# Altium project Universal driver v2.PrjPcb
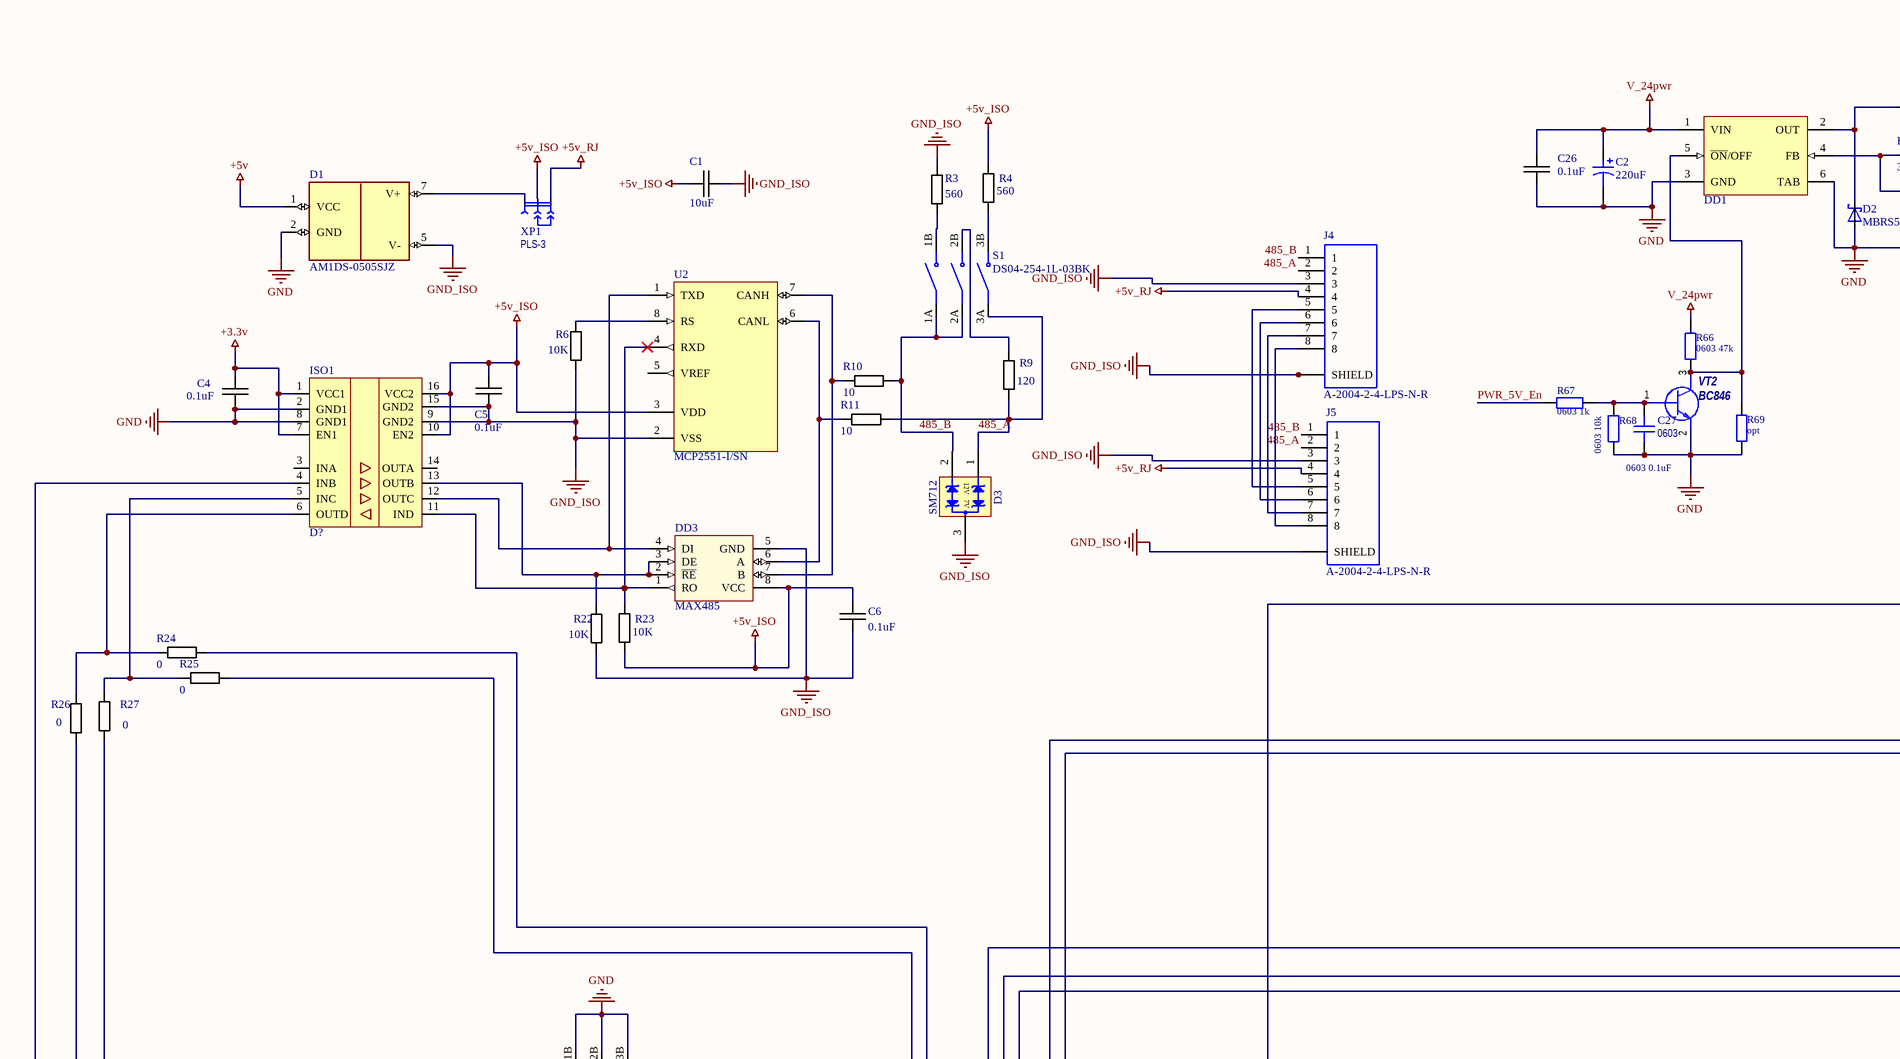
[diagram p0: universal driver v2.SchDoc, top left]
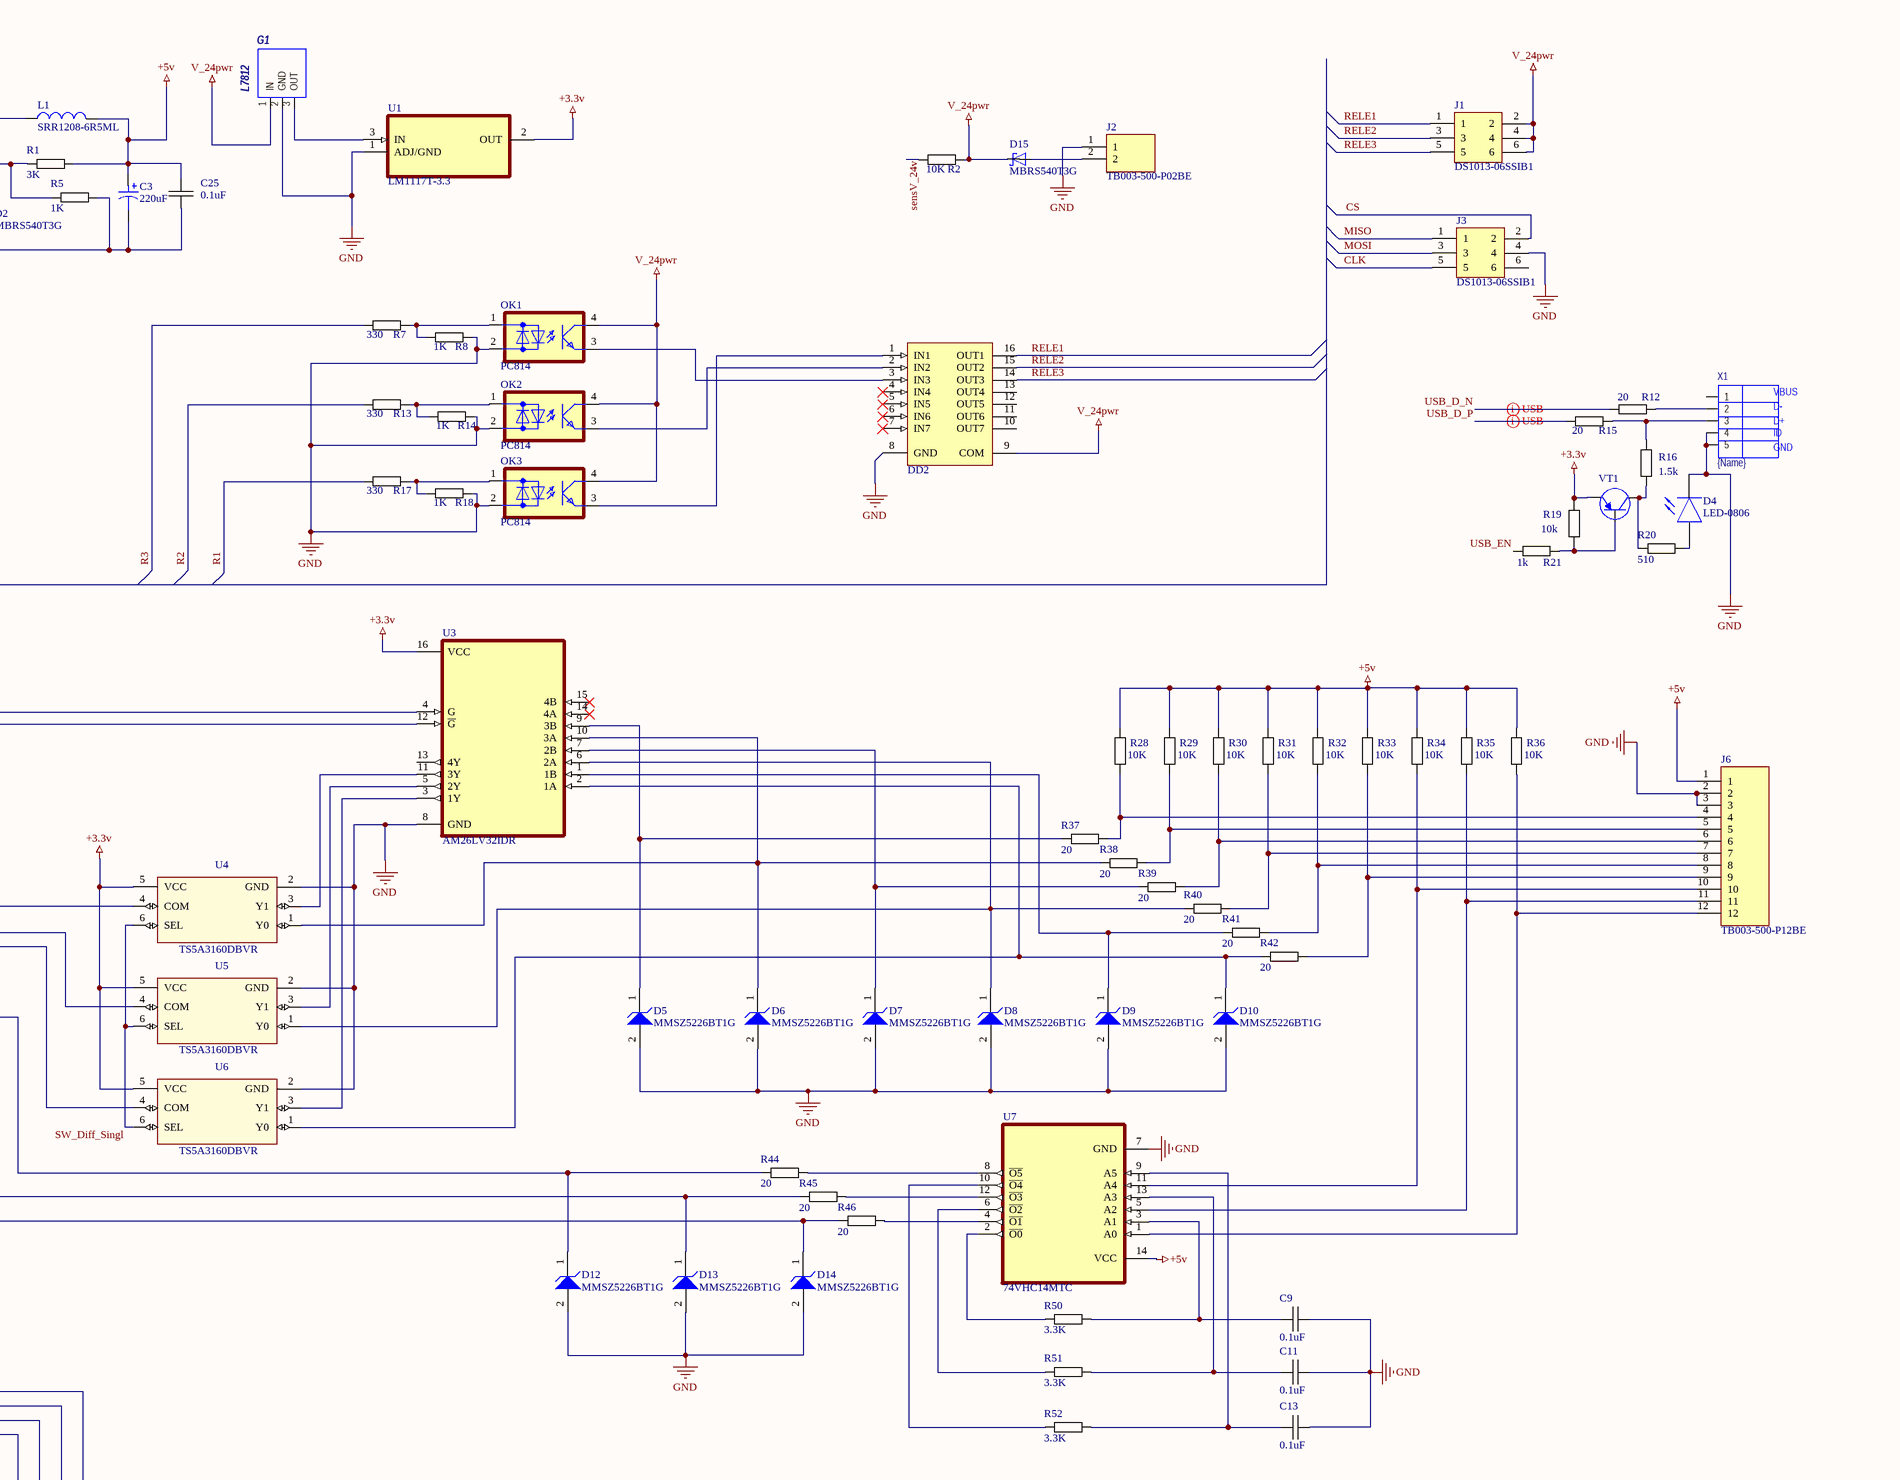
[diagram p1: universal driver v2.SchDoc, top right]
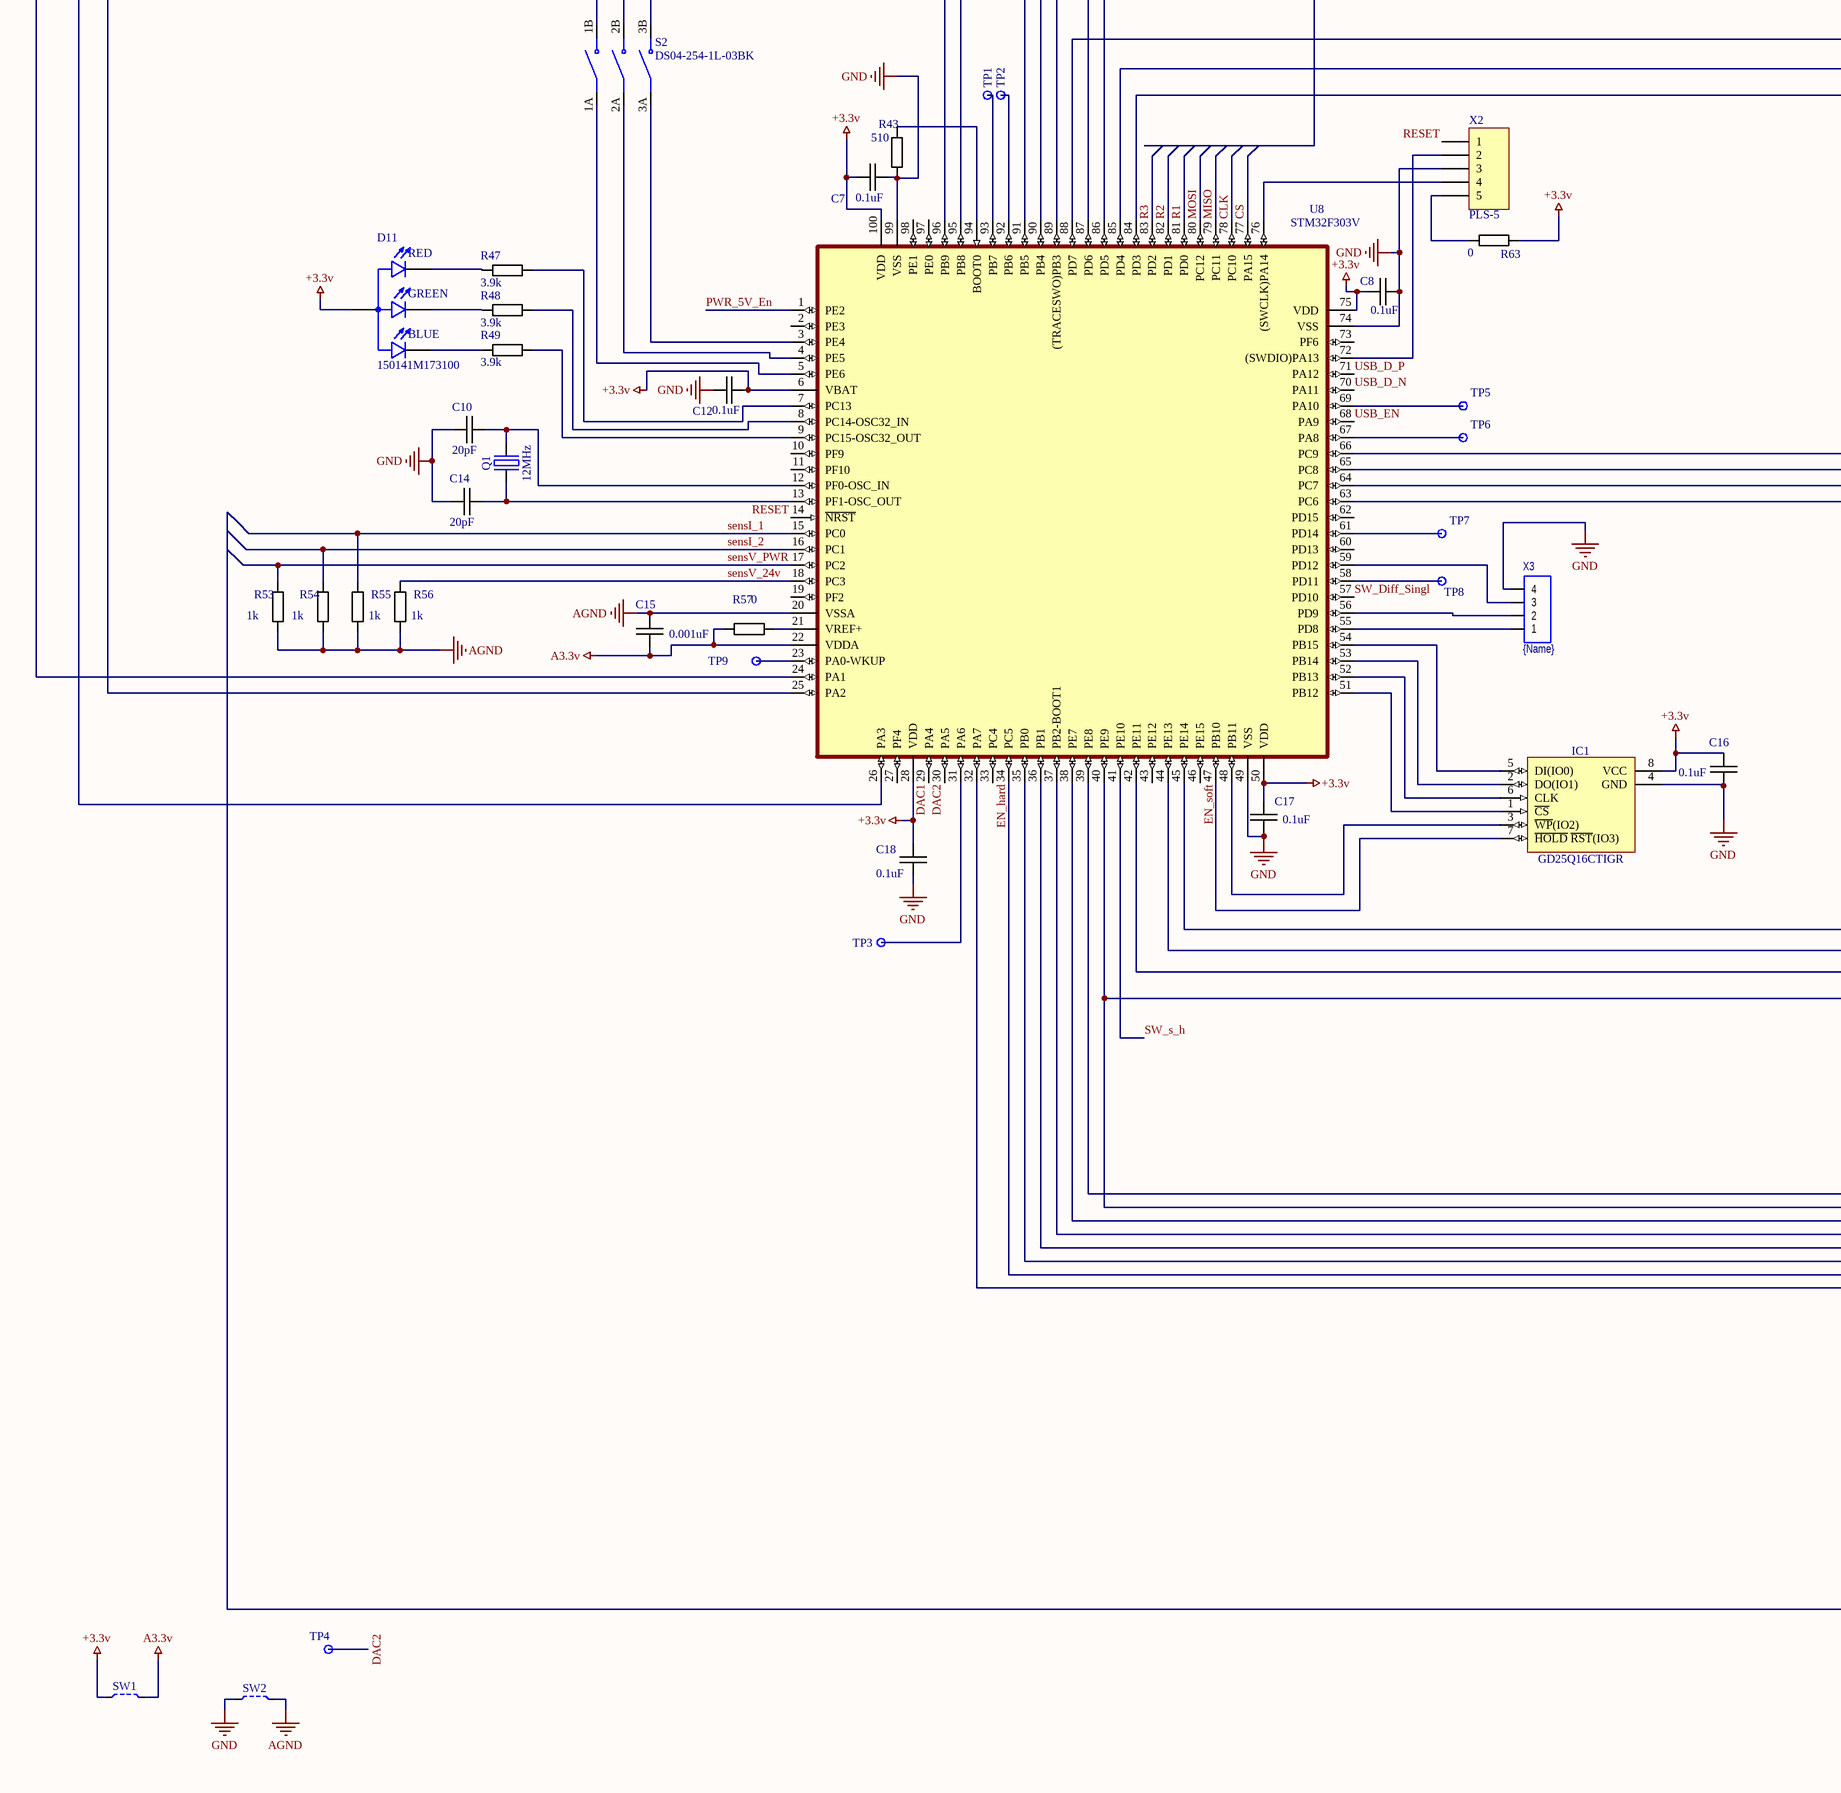
[diagram p2: universal driver v2.SchDoc, bottom left]
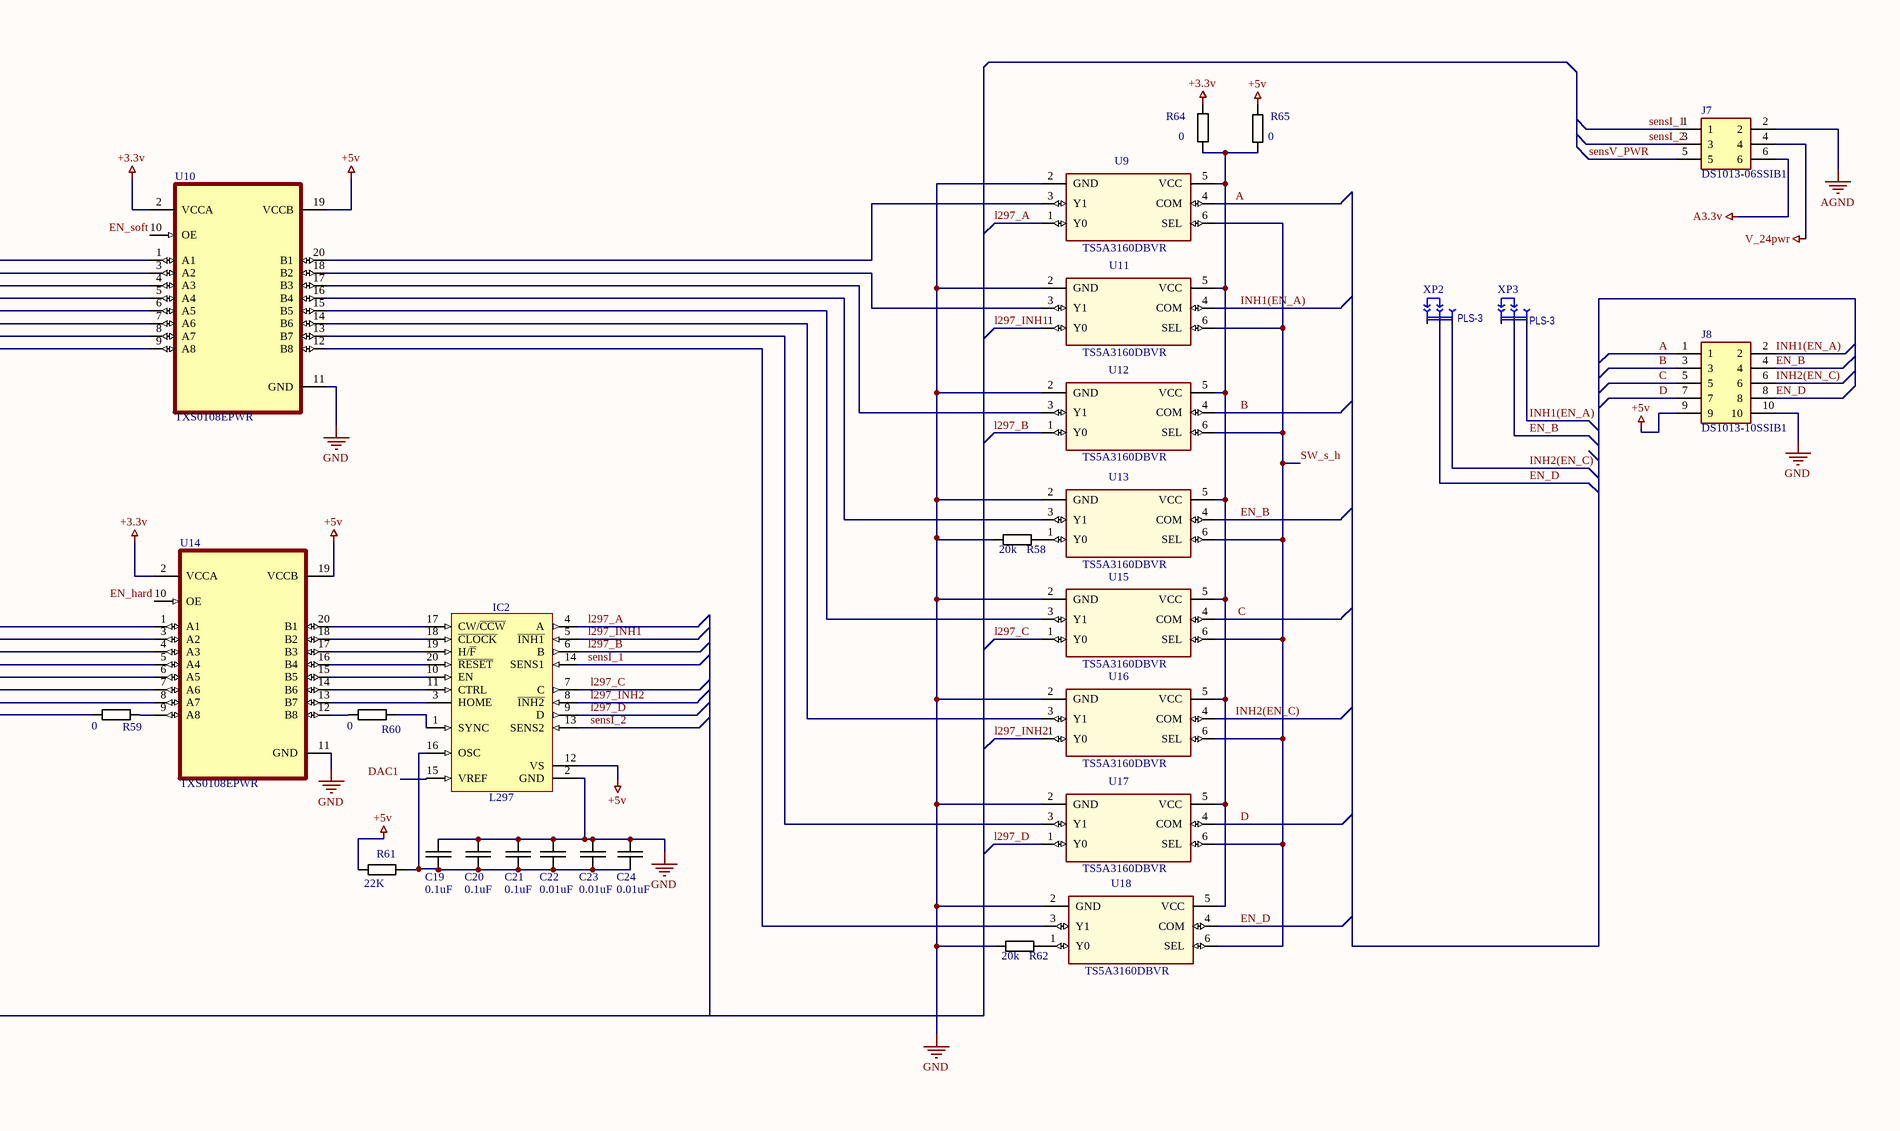
[diagram p3: universal driver v2.SchDoc, bottom right]
1 sheet, 170 parts. Net scope: global (net labels, ports and power ports of the same name join across sheets).
Board file: Universal_Driver v2.PcbDoc

## Sheet universal driver v2.SchDoc
size A1

### Parts
C1  10uF  [CAPC3225X270N]
C2  value 220uF  [ECR 10x13mm]  (hidden comment: 220uF 50v)
C3  value 220uF  [ECR 10x13mm]  (hidden comment: 220uF 50v)
C4  0.1uF  [CAPACITOR 0603]
C5  0.1uF  [CAPACITOR 0603]
C6  0.1uF  [CAPACITOR 0603]
C7  0.1uF  [CAPACITOR 0603]
C8  0.1uF  [CAPACITOR 0603]
C9  0.1uF  [CAPACITOR 0603]
C10  20pF  [CAPACITOR 0603]
C11  0.1uF  [CAPACITOR 0603]
C12  0.1uF  [CAPACITOR 0603]
C13  0.1uF  [CAPACITOR 0603]
C14  20pF  [CAPACITOR 0603]
C15  0.001uF  [CAPACITOR 0603]
C16  0.1uF  [CAPACITOR 0603]
C17  0.1uF  [CAPACITOR 0603]
C18  0.1uF  [CAPACITOR 0603]
C19  0.1uF  [CAPACITOR 0603]
C20  0.1uF  [CAPACITOR 0603]
C21  0.1uF  [CAPACITOR 0603]
C22  0.01uF  [CAPACITOR 0603]
C23  0.01uF  [CAPACITOR 0603]
C24  0.01uF  [CAPACITOR 0603]
C25  0.1uF  [CAPACITOR 0603]
C26  0.1uF  [CAPACITOR 0603]
C27  Body: 0603  [CAPCHIP0603]  (hidden comment: 0603 0.1uF)
D1  AM1DS-0505SJZ  [AM2D-NZ]
D2  MBRS540T3G  [DIOM7958X213N]
D3  SM712  [SOT23]
D4  LED-0806  [RESC0805X60N]
D5  MMSZ5226BT1G  [ONSC-SOD-123-2-425-04_V]
D6  MMSZ5226BT1G  [ONSC-SOD-123-2-425-04_V]
D7  MMSZ5226BT1G  [ONSC-SOD-123-2-425-04_V]
D8  MMSZ5226BT1G  [ONSC-SOD-123-2-425-04_V]
D9  MMSZ5226BT1G  [ONSC-SOD-123-2-425-04_V]
D10  MMSZ5226BT1G  [ONSC-SOD-123-2-425-04_V]
D11  150141M173100  [LED_150141M173100]
D12  MMSZ5226BT1G  [ONSC-SOD-123-2-425-04_V]
D13  MMSZ5226BT1G  [ONSC-SOD-123-2-425-04_V]
D14  MMSZ5226BT1G  [ONSC-SOD-123-2-425-04_V]
D15  MBRS540T3G  [DIOM7958X213N]
DD1  LM2596S-ADJ  [TO-263]  (value not drawn)
DD2  ULN2003  [NSO16]  (value not drawn)
DD3  MAX485  [NSO8]
G1  Name: L7812  [D2PAK_M]  (hidden comment: L7812C - V)
IC1  GD25Q16CTIGR  [NSO8]
IC2  L297  [DIP850W45P254L2540H393Q20]
ISO1  D?  [*SOIC127P1030X265-16N]
J1  DS1013-06SSIB1  [CONNFLY_DS1013-06SSIB1]
J2  TB003-500-P02BE  [CUI_TB003-500-P02BE]
J3  DS1013-06SSIB1  [CONNFLY_DS1013-06SSIB1]
J4  A-2004-2-4-LPS-N-R  [ASSMANN_A-2004-2-4-LPS-N-R]
J5  A-2004-2-4-LPS-N-R  [ASSMANN_A-2004-2-4-LPS-N-R]
J6  TB003-500-P12BE  [CUI_TB003-500-P12BE]
J7  DS1013-06SSIB1  [CONNFLY_DS1013-06SSIB1]
J8  DS1013-10SSIB1  [CONNFLY_DS1013-10SSIB1]
L1  SRR1208-6R5ML  [SRR1208]
OK1  PC814  [DIL04]
OK2  PC814  [DIL04]
OK3  PC814  [DIL04]
Q1  12MHz  [HC49SM]
R1  3K  [Resistor 0805]
R2  10K  [Resistor 0805]
R3  560  [Resistor 0805]
R4  560  [Resistor 0805]
R5  1K  [Resistor 0805]
R6  10K  [Resistor 0805]
R7  330  [Resistor 0805]
R8  1K  [Resistor 0805]
R9  120  [Resistor 0805]
R10  10  [Resistor 0805]
R11  10  [Resistor 0805]
R12  20  [Resistor 0805]
R13  330  [Resistor 0805]
R14  1K  [Resistor 0805]
R15  20  [Resistor 0805]
R16  1.5k  [Resistor 0805]
R17  330  [Resistor 0805]
R18  1K  [Resistor 0805]
R19  10k  [Resistor 0805]
R20  510  [Resistor 0805]
R21  1k  [Resistor 0805]
R22  10K  [Resistor 0805]
R23  10K  [Resistor 0805]
R24  0  [Resistor 0805]
R25  0  [Resistor 0805]
R26  0  [Resistor 0805]
R27  0  [Resistor 0805]
R28  10K  [Resistor 0805]
R29  10K  [Resistor 0805]
R30  10K  [Resistor 0805]
R31  10K  [Resistor 0805]
R32  10K  [Resistor 0805]
R33  10K  [Resistor 0805]
R34  10K  [Resistor 0805]
R35  10K  [Resistor 0805]
R36  10K  [Resistor 0805]
R37  20  [Resistor 0805]
R38  20  [Resistor 0805]
R39  20  [Resistor 0805]
R40  20  [Resistor 0805]
R41  20  [Resistor 0805]
R42  20  [Resistor 0805]
R43  510  [Resistor 0805]
R44  20  [Resistor 0805]
R45  20  [Resistor 0805]
R46  20  [Resistor 0805]
R47  3.9k  [Resistor 0805]
R48  3.9k  [Resistor 0805]
R49  3.9k  [Resistor 0805]
R50  3.3K  [Resistor 0805]
R51  3.3K  [Resistor 0805]
R52  3.3K  [Resistor 0805]
R53  1k  [Resistor 0805]
R54  1k  [Resistor 0805]
R55  1k  [Resistor 0805]
R56  1k  [Resistor 0805]
R57  0  [Resistor 0805]
R58  20k  [Resistor 0805]
R59  0  [Resistor 0805]
R60  0  [Resistor 0805]
R61  22K  [Resistor 0805]
R62  20k  [Resistor 0805]
R63  0  [Resistor 0805]
R64  0  [Resistor 0805]
R65  0  [Resistor 0805]
R66  0603 47k  [RESCHIP0603]
R67  0603 1k  [RESCHIP0603]
R68  0603 10k  [RESCHIP0603]
R69  opt  [RESCHIP0603]
S1  DS04-254-1L-03BK  [SW_DS04-254-1L-03BK]
S2  DS04-254-1L-03BK  [SW_DS04-254-1L-03BK]
SW1  (no value)  [R - 1206]
SW2  (no value)  [R - 1206]
TP1  (no value)  [PIN1]
TP2  (no value)  [PIN1]
TP3  (no value)  [PIN1]
TP4  (no value)  [PIN1]
TP5  (no value)  [PIN1]
TP6  (no value)  [PIN1]
TP7  (no value)  [PIN1]
TP8  (no value)  [PIN1]
TP9  (no value)  [PIN1]
U1  LM1117T-3.3  [TO254P470X1016X2222-3P]
U2  MCP2551-I/SN  [SOIC-SN8_L]
U3  AM26LV32IDR  [SOIC127P600X175-16N]
U4  TS5A3160DBVR  [*SOT95P280X145-6N]
U5  TS5A3160DBVR  [*SOT95P280X145-6N]
U6  TS5A3160DBVR  [*SOT95P280X145-6N]
U7  74VHC14MTC  [SOP65P640X120-14N]
U8  STM32F303V  [QFP50P1600X1600X160-100N]
U9  TS5A3160DBVR  [*SOT95P280X145-6N]
U10  TXS0108EPWR  [SOP65P640X120-20N]
U11  TS5A3160DBVR  [*SOT95P280X145-6N]
U12  TS5A3160DBVR  [*SOT95P280X145-6N]
U13  TS5A3160DBVR  [*SOT95P280X145-6N]
U14  TXS0108EPWR  [SOP65P640X120-20N]
U15  TS5A3160DBVR  [*SOT95P280X145-6N]
U16  TS5A3160DBVR  [*SOT95P280X145-6N]
U17  TS5A3160DBVR  [*SOT95P280X145-6N]
U18  TS5A3160DBVR  [*SOT95P280X145-6N]
VT1  PNP BEC  [SOT23]  (value not drawn)
VT2  BC846  [SOT23]
X1  Name: {Name}  [X - Micro USB B (Bottom mount ass'y)]  (hidden comment: 47346-0001(molex))
X2  PLS-5  [PLS-5-3D]
X3  Name: {Name}  [X - PLS - 4]  (hidden comment: PLS-4)
XP1  PLS-3  [ZL201-3]
XP2  PLS-3  [ZL201-3]
XP3  PLS-3  [ZL201-3]

### Nets
+3.3v: C4.1 C7.1 C8.1 C12.2 C16.1 C17.1 C18.1 D11.1(A) IC1.8(VCC) ISO1.1(VCC1) ISO1.7(EN1) R19.2 R63.1 R64.1 SW1.1 U1.2(OUT) U3.16(VCC) U4.5(VCC) U5.5(VCC) U6.5(VCC) U8.6(VBAT) U8.28(VDD) U8.50(VDD) U8.75(VDD) U8.100(VDD) U10.2(VCCA) U14.2(VCCA) VT1.2(E)
+5v: C3.1 C25.2 D1.1(VCC) IC2.12(VS) J6.1 J8.9 L1.P$2 R1.2 R28.2 R29.2 R30.2 R31.2 R32.2 R33.2 R34.2 R35.2 R36.2 R61.2 R65.1 U7.14(VCC) U10.19(VCCB) U14.19(VCCB)
+5v_ISO: C1.2 C5.2 C6.2 DD3.8(VCC) ISO1.10(EN2) ISO1.16(VCC2) R4.2 R23.1 U2.3(VDD) XP1.2
+5v_RJ: J4.4 J5.4 XP1.1
A3.3v: C15.2 J7.6 R57.2 SW1.2 U8.22(VDDA)
AGND: C15.1 J7.2 R53.2 R54.2 R55.2 R56.2 SW2.2 U8.20(VSSA)
GND: C2.2 C3.2 C4.2 C7.2 C8.2 C9.2 C10.1 C11.2 C12.1 C13.2 C14.1 C16.2 C17.2 C18.2 C19.2 C20.2 C21.2 C22.2 C23.2 C24.2 C25.1 C26.1 C27.1 D1.2(GND) D2.A D4.1(C) D5.2(A) D6.2(A) D7.2(A) D8.2(A) D9.2(A) D10.2(A) D12.2(A) D13.2(A) D14.2(A) DD1.3(GND) DD1.6(TAB) DD2.8(GND) G1.2(GND) IC1.4(GND) IC2.2(GND) ISO1.2(GND1) ISO1.8(GND1) J2.1 J3.4 J6.2 J6.3 J8.10 OK1.2(AC2) OK2.2(AC2) OK3.2(AC2) R5.2 R8.2 R14.2 R18.2 R43.2 R58.1 R62.1 R68.2 R69.2 S2.1B(NO1) S2.2B(NO2) S2.3B(NO3) SW2.1 U1.1(ADJ/GND) U3.8(GND) U4.2(GND) U5.2(GND) U6.2(GND) U7.7(GND) U8.49(VSS) U8.74(VSS) U8.99(VSS) U9.2(GND) U10.11(GND) U11.2(GND) U12.2(GND) U13.2(GND) U14.11(GND) U15.2(GND) U16.2(GND) U17.2(GND) U18.2(GND) VT2.2(E) X1.4 X1.5 X2.3 X3.4
GND_ISO: C1.1 C5.1 C6.1 D1.5(V-) D3.3(GND) DD3.5(GND) ISO1.9(GND2) ISO1.15(GND2) J4.3 J4.S1(SHIELD) J4.S2(SHIELD) J5.3 J5.S1(SHIELD) J5.S2(SHIELD) R3.2 R6.1 R22.2 U2.2(VSS)
V_24pwr: C2.1 C26.2 D15.C DD1.1(VIN) DD2.9(COM) G1.1(IN) J1.2 J1.4 J1.6 J7.4 OK1.4(C) OK2.4(C) OK3.4(C) R2.2 R66.2
485_A: D3.1(I/O1) J4.2 J5.2 R9.2 R11.1 S1.3A(COM3)
485_B: D3.2(I/O2) J4.1 J5.1 R10.1 S1.1A(COM1) S1.2A(COM2)
A: J8.1 U9.4(COM)
B: J8.3 U12.4(COM)
C: J8.5 U15.4(COM)
CLK: J3.5 U8.78(PC10)
CS: J3.2 U8.77(PA15)
D: J8.7 U17.4(COM)
DAC1: IC2.15(VREF) U8.29(PA4)
DAC2: TP4.1 U8.30(PA5)
EN_B: J8.4 U13.4(COM) XP3.2
EN_D: J8.8 U18.4(COM) XP2.2
EN_hard: U8.33(PC4) U14.10(OE)
EN_soft: U8.46(PE15) U10.10(OE)
INH1(EN_A): J8.2 U11.4(COM) XP3.3
INH2(EN_C): J8.6 U16.4(COM) XP2.3
l297_A: IC2.4(A) U9.1(Y0)
l297_B: IC2.6(B) U12.1(Y0)
l297_C: IC2.7(C) U15.1(Y0)
l297_D: IC2.9(D) U17.1(Y0)
l297_INH1: IC2.5(~{INH1}) U11.1(Y0)
l297_INH2: IC2.8(~{INH2}) U16.1(Y0)
MISO: J3.1 U8.79(PC11)
MOSI: J3.3 U8.80(PC12)
PWR_5V_En: R67.1 U8.1(PE2)
R1: R17.1 U8.81(PD0)
R2: R13.1 U8.82(PD1)
R3: R7.1 U8.83(PD2)
RELE1: DD2.16(OUT1) J1.1
RELE2: DD2.15(OUT2) J1.3
RELE3: DD2.14(OUT3) J1.5
RESET: U8.14(~{NRST}) X2.1
sensI_1: IC2.14(SENS1) J7.1 R55.1 U8.15(PC0)
sensI_2: IC2.13(SENS2) J7.3 R54.1 U8.16(PC1)
sensV_24v: R2.1 R56.1 U8.18(PC3)
sensV_PWR: J7.5 R53.1 U8.17(PC2)
SW_Diff_Singl: U4.6(SEL) U5.6(SEL) U6.6(SEL) U8.57(PD10)
SW_s_h: U8.41(PE10) U9.6(SEL) U11.6(SEL) U12.6(SEL) U13.6(SEL) U15.6(SEL) U16.6(SEL) U17.6(SEL) U18.6(SEL)
USB_D_N: R12.1 U8.70(PA11)
USB_D_P: R15.1 U8.71(PA12)
USB_EN: R21.1 U8.68(PA9)
NetC9_1: C9.1 R50.1 U7.3(A1)
NetC10_2: C10.2 Q1.2(OSC2) U8.12(PF0-OSC_IN)
NetC11_1: C11.1 R51.1 U7.13(A3)
NetC13_1: C13.1 R52.1 U7.9(A5)
NetC14_2: C14.2 Q1.1(OSC1) U8.13(PF1-OSC_OUT)
NetC19_1: C19.1 C20.1 C21.1 C22.1 C23.1 C24.1 IC2.16(OSC) R61.1
NetC27_2: C27.2 R67.2 R68.1 VT2.1(B)
NetD1_7: D1.7(V+) XP1.3
NetD2_C: D2.C DD1.2(OUT) L1.P$1
NetD4_2: D4.2(A) R20.1
NetD5_1: D5.1(K) R37.2 U3.9(3B)
NetD6_1: D6.1(K) R38.2 U3.10(3A) U4.1(Y0)
NetD7_1: D7.1(K) R39.2 U3.7(2B)
NetD8_1: D8.1(K) R40.2 U3.6(2A) U5.1(Y0)
NetD9_1: D9.1(K) R41.2 U3.1(1B)
NetD10_1: D10.1(K) R42.2 U3.2(1A) U6.1(Y0)
NetD11_2: D11.2(B_C) R49.2
NetD11_3: D11.3(R_C) R47.2
NetD11_4: D11.4(G_C) R48.2
NetD12_1: D12.1(K) R44.2 U8.88(PD7)
NetD13_1: D13.1(K) R45.2 U8.85(PD4)
NetD14_1: D14.1(K) R46.2 U8.84(PD3)
NetD15_A: D15.A J2.2
NetDD1_4: DD1.4(FB) R1.1 R5.1
NetDD1_5: DD1.5(~{ON}/OFF) R66.1 R69.1 VT2.3(C)
NetDD2_1: DD2.1(IN1) OK3.3(E)
NetDD2_2: DD2.2(IN2) OK2.3(E)
NetDD2_3: DD2.3(IN3) OK1.3(E)
NetDD3_1: DD3.1(RO) ISO1.11(IND) R23.2 U2.4(RXD)
NetDD3_2: DD3.2(~{RE}) DD3.3(DE) ISO1.13(OUTB) R22.1
NetDD3_4: DD3.4(DI) ISO1.12(OUTC) U2.1(TXD)
NetDD3_6: DD3.6(A) R11.2 U2.6(CANL)
NetDD3_7: DD3.7(B) R10.2 U2.7(CANH)
NetG1_3: G1.3(OUT) U1.3(IN)
NetIC1_1: IC1.1(~{CS}) U8.51(PB12)
NetIC1_2: IC1.2(DO(IO1)) U8.53(PB14)
NetIC1_3: IC1.3(~{WP}(IO2)) U8.48(PB11)
NetIC1_5: IC1.5(DI(IO0)) U8.54(PB15)
NetIC1_6: IC1.6(CLK) U8.52(PB13)
NetIC1_7: IC1.7(~{HOLD}_~{RST}(IO3)) U8.47(PB10)
NetIC2_1: IC2.1(SYNC) R60.1
NetIC2_3: IC2.3(HOME) U14.13(B7)
NetIC2_10: IC2.10(EN) U14.15(B5)
NetIC2_11: IC2.11(CTRL) U14.14(B6)
NetIC2_17: IC2.17(CW/~{CCW}) U14.20(B1)
NetIC2_18: IC2.18(~{CLOCK}) U14.18(B2)
NetIC2_19: IC2.19(H/~{F}) U14.17(B3)
NetIC2_20: IC2.20(~{RESET}) U14.16(B4)
NetISO1_4: ISO1.4(INB) U8.24(PA1)
NetISO1_5: ISO1.5(INC) R25.2 R27.2
NetISO1_6: ISO1.6(OUTD) R24.2 R26.1
NetJ4_5: J4.5 J5.5
NetJ4_6: J4.6 J5.6
NetJ4_7: J4.7 J5.7
NetJ4_8: J4.8 J5.8
NetJ6_4: J6.4 R28.1 R37.1
NetJ6_5: J6.5 R29.1 R38.1
NetJ6_6: J6.6 R30.1 R39.1
NetJ6_7: J6.7 R31.1 R40.1
NetJ6_8: J6.8 R32.1 R41.1
NetJ6_9: J6.9 R33.1 R42.1
NetJ6_10: J6.10 R34.1 U7.11(A4)
NetJ6_11: J6.11 R35.1 U7.5(A2)
NetJ6_12: J6.12 R36.1 U7.1(A0)
NetOK1_1: OK1.1(AC1) R7.2 R8.1
NetOK2_1: OK2.1(AC1) R13.2 R14.1
NetOK3_1: OK3.1(AC1) R17.2 R18.1
NetR3_1: R3.1 S1.1B(NO1)
NetR4_1: R4.1 S1.3B(NO3)
NetR6_2: R6.2 U2.8(RS)
NetR9_1: R9.1 S1.2B(NO2)
NetR12_2: R12.2 X1.2
NetR15_2: R15.2 R16.1 X1.3
NetR16_2: R16.2 R20.2 VT1.3(C)
NetR19_1: R19.1 R21.2 VT1.1(B)
NetR24_1: R24.1 U8.95(PB8)
NetR25_1: R25.1 U8.96(PB9)
NetR26_2: R26.2 U8.26(PA3)
NetR27_1: R27.1 U8.25(PA2)
NetR43_1: R43.1 U8.94(BOOT0)
NetR44_1: R44.1 U7.8(~{O5})
NetR45_1: R45.1 U7.12(~{O3})
NetR46_1: R46.1 U7.4(~{O1})
NetR47_1: R47.1 U8.7(PC13)
NetR48_1: R48.1 U8.8(PC14-OSC32_IN)
NetR49_1: R49.1 U8.9(PC15-OSC32_OUT)
NetR50_2: R50.2 U7.2(~{O0})
NetR51_2: R51.2 U7.6(~{O2})
NetR52_2: R52.2 U7.10(~{O4})
NetR57_1: R57.1 U8.21(VREF+)
NetR58_2: R58.2 U13.1(Y0)
NetR59_1: R59.1 U14.9(A8)
NetR59_2: R59.2 U8.32(PA7)
NetR60_2: R60.2 U14.12(B8)
NetR62_2: R62.2 U18.1(Y0)
NetR63_2: R63.2 X2.5
NetR64_2: R64.2 R65.2 U9.5(VCC) U11.5(VCC) U12.5(VCC) U13.5(VCC) U15.5(VCC) U16.5(VCC) U17.5(VCC) U18.5(VCC)
NetS2_1A: S2.1A(COM1) U8.5(PE6)
NetS2_2A: S2.2A(COM2) U8.4(PE5)
NetS2_3A: S2.3A(COM3) U8.3(PE4)
NetTP1_1: TP1.1 U8.93(PB7)
NetTP2_1: TP2.1 U8.92(PB6)
NetTP3_1: TP3.1 U8.31(PA6)
NetTP5_1: TP5.1 U8.69(PA10)
NetTP6_1: TP6.1 U8.67(PA8)
NetTP7_1: TP7.1 U8.61(PD14)
NetTP8_1: TP8.1 U8.58(PD11)
NetTP9_1: TP9.1 U8.23(PA0-WKUP)
NetU3_3: U3.3(1Y) U6.3(Y1)
NetU3_4: U3.4(G) U8.87(PD6)
NetU3_5: U3.5(2Y) U5.3(Y1)
NetU3_11: U3.11(3Y) U4.3(Y1)
NetU3_12: U3.12(~{G}) U8.86(PD5)
NetU4_4: U4.4(COM) U8.91(PB5)
NetU5_4: U5.4(COM) U8.90(PB4)
NetU6_4: U6.4(COM) U8.89((TRACESWO)PB3)
NetU8_34: U8.34(PC5) U14.8(A7)
NetU8_35: U8.35(PB0) U14.7(A6)
NetU8_36: U8.36(PB1) U14.6(A5)
NetU8_37: U8.37(PB2-BOOT1) U14.5(A4)
NetU8_38: U8.38(PE7) U14.4(A3)
NetU8_39: U8.39(PE8) U14.1(A1)
NetU8_40: U8.40(PE9) U10.9(A8) U14.3(A2)
NetU8_42: U8.42(PE11) U10.8(A7)
NetU8_44: U8.44(PE13) U10.7(A6)
NetU8_45: U8.45(PE14) U10.6(A5)
NetU8_55: U8.55(PD8) X3.1
NetU8_56: U8.56(PD9) X3.2
NetU8_59: U8.59(PD12) X3.3
NetU8_63: U8.63(PC6) U10.5(A4)
NetU8_64: U8.64(PC7) U10.4(A3)
NetU8_65: U8.65(PC8) U10.3(A2)
NetU8_66: U8.66(PC9) U10.1(A1)
NetU8_72: U8.72((SWDIO)PA13) X2.2
NetU8_76: U8.76((SWCLK)PA14) X2.4
NetU9_3: U9.3(Y1) U10.20(B1)
NetU10_12: U10.12(B8) U18.3(Y1)
NetU10_13: U10.13(B7) U17.3(Y1)
NetU10_14: U10.14(B6) U16.3(Y1)
NetU10_15: U10.15(B5) U15.3(Y1)
NetU10_16: U10.16(B4) U13.3(Y1)
NetU10_17: U10.17(B3) U12.3(Y1)
NetU10_18: U10.18(B2) U11.3(Y1)

Not connected (* = marked no-connect by the designer): DD2 4(IN4)* 5(IN5)* 6(IN6)* 7(IN7)* 10(OUT7) 11(OUT6) 12(OUT5) 13(OUT4); ISO1 3(INA) 14(OUTA); J3 6; U2 5(VREF); U3 13(4Y) 14(4A)* 15(4B)*; U8 2(PE3) 10(PF9) 11(PF10) 19(PF2) 27(PF4) 43(PE12) 60(PD13) 62(PD15) 73(PF6) 97(PE0) 98(PE1); X1 1; XP2 1; XP3 1

### Layout directives
differential pair: USB_D_N, USB_D_P

### Notes on the sheet
- (in symbol 150141M173100) RED; GREEN; BLUE
- (in symbol SM712) 12V; 7V
- (in symbol X - Micro USB B (Bottom mount ass'y)) VBUS; D-; D+; ID; GND

### Library data of the parts
C1 C4-C26 = Capasitor: Value: *
C2 C3 = Cap Pol: Polarized Capacitor (Rad); Voltage: 50; Type: Type; URL: http://www.hitano.com.tw/PDF/ECR_081225.pdf
C27 = Cap C: Ceramic Capacitor; Class: Электронные компоненты; Installation: SMD; Nominal_voltage_V: 50; Ordering_Information: 0603, 0.1uF, 50V; SubClass: Конденсаторы; TKE: {TKE}; Value: 0603 0.1uF; Pins: 2
D2 D15 = MBRS540T3G: Diode Schottky 40V 5A Surface Mount SMC; MF: ON Semiconductor; SnapEDA_Link: https://www.snapeda.com/parts/MBRS540T3G/ON%20Semiconductor/view-part/78777/?ref=snap; MP: MBRS540T3G; Availability: Unavailable; Price: None; Value: *; Package: DO-214 ON Semiconductor
D3 = SM712: Asymmetrical TVS Diode for Extended Common-Mode RS-485
D5-D10 D12-D14 = MMSZ5226BT1G: Zener Voltage Regulator, 500 mW, 2-Pin SOD-123, Pb-Free, Tape and Reel; Manufacturer: On Semiconductor; P Max (W): 0.5; VZ Typ (V): 3.3; DatasheetVersion: Rev. 12; PackageVersion: Rev. G, 10/2009; PackageReference: SOD-123-2-425-04; PackageDescription: 2-Pin SOD, Body 1.6 x 2.69 mm; Supplier 1: Digi-Key; Supplier Part Number 1: MMSZ5226BT1GOSTR-ND; Supplier 2: Digi-Key; Supplier Part Number 2: MMSZ5226BT1GOSCT-ND; Supplier 3: Digi-Key; Supplier Part Number 3: MMSZ5226BT1GOSDKR-ND; Supplier 4: Farnell; Supplier Part Number 4: 1431269; Supplier 5: Farnell; Supplier Part Number 5: 1431269RL; Supplier 6: Farnell; Supplier Part Number 6: 2370825; Supplier 7: Newark; Supplier Part Number 7: 67R1367; Supplier 8: Newark; Supplier Part Number 8: 45J1591; Supplier 9: Mouser; Supplier Part Number 9: 863-MMSZ5226BT1G; Packing: Tape and Reel; RoHS: Pb-Free; Mounting Technology: Surface Mount; PartNumber: MMSZ5226BT1G; ComponentLink1Description: Manufacturer URL; ComponentLink1URL: http://www.onsemi.com/; ComponentLink2Description: Datasheet; ComponentLink2URL: http://www.onsemi.com/pub_link/Collateral/MMSZ5221BT1-D.PDF; ComponentLink3Description: Package Specification; ComponentLink3URL: http://www.onsemi.com/pub_link/Collateral/425-04.PDF
D11 = 150141M173100: Red, Green, Blue _RGB_ 625nm Red, 520nm Green, 470nm Blue LED Indication - Discrete 2V Red, 3.2V Green, 3.2V Blue 1411 _3528 Metric_; MF: Wurth Electronics; SnapEDA_Link: https://www.snapeda.com/parts/150141M173100/Wurth%20Electronics%20Inc./view-part/281733/?ref=snap; Price: None; MP: 150141M173100; Package: 1411 WÃ¼rth Elektronik; Value: *; Availability: Unavailable
DD1 = LM2596S-ADJ: SIMPLE SWITCHER® Power Converter 150 KHz 3A Step-Down Voltage Regulator, 5-pin TO-263; Manufacturer: National Semiconductor; Published: 13.04.2012; Publisher: Reukov A.V.; PartNumber: LM2596S-ADJ; CompType: Switcher; ComponentLink1URL: http://www.national.com/ds/LM/LM2596.pdf; ComponentLink2URL: http://www.national.com/pf/LM/LM2596.html; ComponentLink3URL: http://www.national.com/packaging/folders/ts5b.html
DD2 = ULN2003: High-Voltage, High-Current Darlington Array; Published: 16.07.2012; Publisher: Reukov A.V.
DD3 = MAX485: Low-Power, Slew-Rate-Limited RS-485/RS-422 Transceiver; ComponentLink1URL: http://pdfserv.maxim-ic.com/en/ds/MAX1487-MAX491.pdf; Type: MAX485
G1 = G - L7812: Линейный стабилизатор 12В 0,5А; Indication: {Indication}; Value: L7812C - V
IC1 = W25Q128FVEIG: 128M-bit Serial Flash Memory with uniform 4KB sectors and Dual/Quad SPI and QPI
IC2 = L297: Stepper Motor Controller
ISO1 = ISO7341
J1 J3 J7 = DS1013-06SSIB1: Socket; IDC; male; PIN: 6; straight; THT; gold plated; 2.54mm
J2 = TB003-500-P02BE: 2~24 Poles, Screw Type, Horizontal, 5.0 Pitch, 26~14 _AWG_, Terminal Block Connector; MF: CUI Devices; MP: TB003-500-P02BE; Availability: Unavailable; Package: None; SnapEDA_Link: https://www.snapeda.com/parts/TB003-500-P02BE/CUI%20Devices/view-part/3590637/?ref=snap; Price: None; Value: *
J4 J5 = A-2004-2-4-LPS-N-R: Jack Modular Connector 8p8c _RJ45, Ethernet_ 90Â° Angle _Right_ Shielded; MF: Assmann WSW; Package: None; MP: A-2004-2-4-LPS-N-R; Value: *; Price: None; Availability: Unavailable; SnapEDA_Link: https://www.snapeda.com/parts/A-2004-2-4-LPS-N-R/Assmann%20WSW%20Components/view-part/454861/?ref=snap
J6 = TB003-500-P12BE: 2~24 Poles, Screw Type, Horizontal, 5.0 Pitch, 26~14 (AWG), Terminal Block Connector; MF: CUI Devices; Availability: Bad; Check_prices: https://www.snapeda.com/parts/TB003-500-P12BE/CUI%20Devices/view-part/3590687/?ref=eda; Package: None; Price: None; SnapEDA_Link: https://www.snapeda.com/parts/TB003-500-P12BE/CUI%20Devices/view-part/3590687/?ref=snap; Value: *; CUI_purchase_URL: https://www.cuidevices.com/product/interconnect/connectors/terminal-blocks/tb003-500-series?utm_source=snapeda.com&utm_medium=referral&utm_campaign=snapedaBOM; MP: TB003-500-P12BE
J8 = DS1013-10SSIB1: Socket; IDC; male; PIN: 10; straight; THT; gold plated; 2.54mm; MF: Connfly; Availability: Unavailable; Price: None; Package: None; Value: *; SnapEDA_Link: https://www.snapeda.com/parts/DS1013-10SSIB1/Connfly/view-part/951223/?ref=snap; MP: DS1013-10SSIB1; BuyPart: https://www.snapeda.com/parts/DS1013-10SSIB1/Connfly/view-part/951223/?ref=eda
L1 = SRR1208-6R5ML: 6.5ÂµH Shielded Wirewound Inductor 6A 18mOhm Max Nonstandard; MF: Bourns; Availability: Unavailable; SnapEDA_Link: https://www.snapeda.com/parts/SRR1208-6R5ML/Bourns/view-part/353452/?ref=snap; Value: *; Package: Nonstandard Bourns; MP: SRR1208-6R5ML; Price: None
OK1-OK3 = PC814: #10-32 Round Head Machine Screw Slotted Drive Nylon; MF: Essentra Components; Package: DIP-4 Sharp; Value: *; Price: None; MP: PC814; Availability: Unavailable; SnapEDA_Link: https://www.snapeda.com/parts/PC814/Essentra%20Components/view-part/624045/?ref=snap
Q1 = Quartz Crystal
R1-R65 = Resistor: Value: *
R66 R67 = Res: Resistor; Body: 0603; Class: Электронные компоненты; Installation: SMD; Ordering_Information: 0603, 1k, 5%; Power_W: 0.065; SubClass: Резисторы; Tolerance_Percent: 5; Pins: 2
  R66: Value: 0603 47k
  R67: Value: 0603 1k
R68 = Res: Resistor; Body: 0603; Class: Электронные компоненты; Installation: SMD; Ordering_Information: 0603, 10k, 5%; Power_W: 0,065; SubClass: Резисторы; Tolerance_Percent: 5; Value: 0603 10k; Pins: 2
R69 = Res: Resistor; Class: Электронные компоненты; Installation: SMD; Ordering_Information: 0805, 5,1k, 5%; Power_W: 0,125; SubClass: Резисторы; Tolerance_Percent: 5; Value: opt; Pins: 2
S1 S2 = DS04-254-1L-03BK: 3 Pole, Raised Actuator, Flat Bottom, Long Pin, DIP Switch; MF: CUI Devices; Price: None; SnapEDA_Link: https://www.snapeda.com/parts/DS04-254-1L-03BK/CUI%20Devices/view-part/4467361/?ref=snap; Availability: Unavailable; Value: *; MP: DS04-254-1L-03BK; Package: None
SW1 SW2 = SMD Solder Jumper: 2 SMD Pads for Bound by Solder  Drop
TP1-TP9 = Test Point
U1 = LM1117T-3.3: Linear Voltage Regulator IC 1 Output 800mA TO-220-3; MF: Texas Instruments; MP: LM1117T-3.3; Price: None; Availability: Unavailable; Package: TO-220 Texas Instruments; SnapEDA_Link: https://www.snapeda.com/parts/LM1117T-3.3/Texas%20Instruments/view-part/103788/?ref=snap; Value: *
U2 = MCP2551-I/SN: High-Speed CAN Transceiver, 8-Pin SOIC, Industrial Temperature; Published: 29-Jan-2009; DatasheetVersion: revE, Jan-2007; PackageVersion: revBB, Aug-2009; PackageReference: SOIC-SN8; Publisher: Altium Limited; PackageDescription: 8-Lead Plastic Small Outline (SN) - Narrow, 3.90mm Body [SOIC]; Supplier 1: Digi-Key; Supplier Part Number 1: MCP2551-I/SN-ND; Supplier 2: Farnell; Supplier Part Number 2: 9758569; Code_JEDEC: MS-012; Code_IPC: SOIC127P600-8; ComponentLink1Description: Datasheet; ComponentLink1URL: http://ww1.microchip.com/downloads/en/DeviceDoc/21667E.pdf; ComponentLink2Description: Packaging Specification; ComponentLink2URL: http://www.microchip.com/stellent/groups/techpub_sg/documents/packagingspec/en012702.pdf; ComponentLink3Description: Microchip.com Home; ComponentLink3URL: http://www.microchip.com/
U3 = AM26LV32IDR: Low-Voltage High-Speed Quadruple Differential Line Receiver 16-SOIC -40 to 85; MF: Texas Instruments; MP: AM26LV32IDR; Package: SOIC-16 Texas Instruments; Purchase-URL: https://pricing.snapeda.com/search/part/AM26LV32IDR/?ref=eda; SnapEDA_Link: https://www.snapeda.com/parts/AM26LV32IDR/Texas%20Instruments/view-part/95750/?ref=snap; Availability: Good; Price: None; Value: *; Check_prices: https://www.snapeda.com/parts/AM26LV32IDR/Texas%20Instruments/view-part/95750/?ref=eda
U4-U6 U9 U11-U13 U15-U18 = TS5A3160DBVR: 1-?, 5-V, 2:1 (SPDT), analog switch (6-pin SOT-23, SC70 packages) 6-SOT-23 -40 to 85; MF: Texas Instruments; DigiKey-Purchase-URL: https://snapeda.com/shop?store=DigiKey&id=332002; Arrow_Electronics-Purchase-URL: https://snapeda.com/shop?store=Arrow+Electronics&id=332002; Texas_Instruments-Purchase-URL: https://snapeda.com/shop?store=Texas+Instruments&id=332002; Package: SOT-23-6 Texas Instruments; Availability: Good; MP: TS5A3160DBVR; Check_prices: https://www.snapeda.com/parts/TS5A3160DBVR/Texas%20Instruments/view-part/332002/?ref=eda; Mouser-Purchase-URL: https://snapeda.com/shop?store=Mouser&id=332002; SnapEDA_Link: https://www.snapeda.com/parts/TS5A3160DBVR/Texas%20Instruments/view-part/332002/?ref=snap; Price: None; Value: *
U7 = 74VHC14MTC: Inverter IC 6 Channel Schmitt Trigger 14-TSSOP; MF: ON Semiconductor; Value: *; SnapEDA_Link: https://www.snapeda.com/parts/74VHC14MTC/ON%20Semiconductor/view-part/2773904/?ref=snap; Package: TSSOP-14 ON Semiconductor; MP: 74VHC14MTC; Check_prices: https://www.snapeda.com/parts/74VHC14MTC/ON%20Semiconductor/view-part/2773904/?ref=eda; Price: None; Availability: Unavailable
U8 = STM32F303V: ARMÂ® CortexÂ®-M4 STM32F3 Microcontroller IC 32-Bit 72MHz 100-LQFP (14x14); MF: STMicroelectronics; Price: None; Value: *; Availability: Unavailable; Package: LQFP-100 STMicroelectronics; MP: STM32F303V
U10 U14 = TXS0108EPWR: 8-Bit Bidirectional Voltage-Level Shifter For Open-Drain And Push-Pull Application; MF: Texas Instruments; DigiKey-Purchase-URL: https://snapeda.com/shop?store=DigiKey&id=105750; Value: *; MP: TXS0108EPWR; Texas_Instruments-Purchase-URL: https://snapeda.com/shop?store=Texas+Instruments&id=105750; Availability: Unavailable; Package: TSSOP-20 Texas Instruments; Mouser-Purchase-URL: https://snapeda.com/shop?store=Mouser&id=105750; SnapEDA_Link: https://www.snapeda.com/parts/TXS0108EPWR/Texas%20Instruments/view-part/105750/?ref=snap; Price: None
VT1 = BC807: PNP Bipolar Transistor; Published: 8-Jun-2000; Publisher: Reukov A.V.
VT2 = VT - BC846: NPN транзистор; Indication: {Indication}; Value: BC846; Name: BC846
X1 = X - Micro USB B (Bottom mount ass'y): Микро USB B разъем с нижним креплением; Indication: {Indication}; Value: 47346-0001(molex)
X2 = PLS-5: Header, 5-Pin; LatestRevisionDate: 17-Jul-2002; LatestRevisionNote: Re-released for DXP Platform.; Publisher: Altium Limited
X3 = X - PLS-4: Рядный разъем PLS-4.; Indication: {Indication}; Value: PLS-4
XP1-XP3 = Select jump: Connector, 3-Pin; Class: Электронные компоненты; SubClass: Разъемы; Pitch_mm: {Pitch_mm}; Installation: DIP; Ordering_Information: {Ordering_Information}; Type_of_connector: {Type_of_connector}; Pins: 3; Value: PLS-3